# EasyEDA Pro project ProPrj_Altruist.epro, schematic Schematic TH
Board Name: BME280; Create Date: 2024-12-26; Page Name: TH; Project Name: Altruist rc: v0.1.1; Schematic Name: Schematic TH; Update Date: 2024-12-26; Company: Robonomics.network; Drawn: chegurov; Page Size: A5; Part Number: Robo_altruist; Reviewed: ludovich88; Version: V0.1
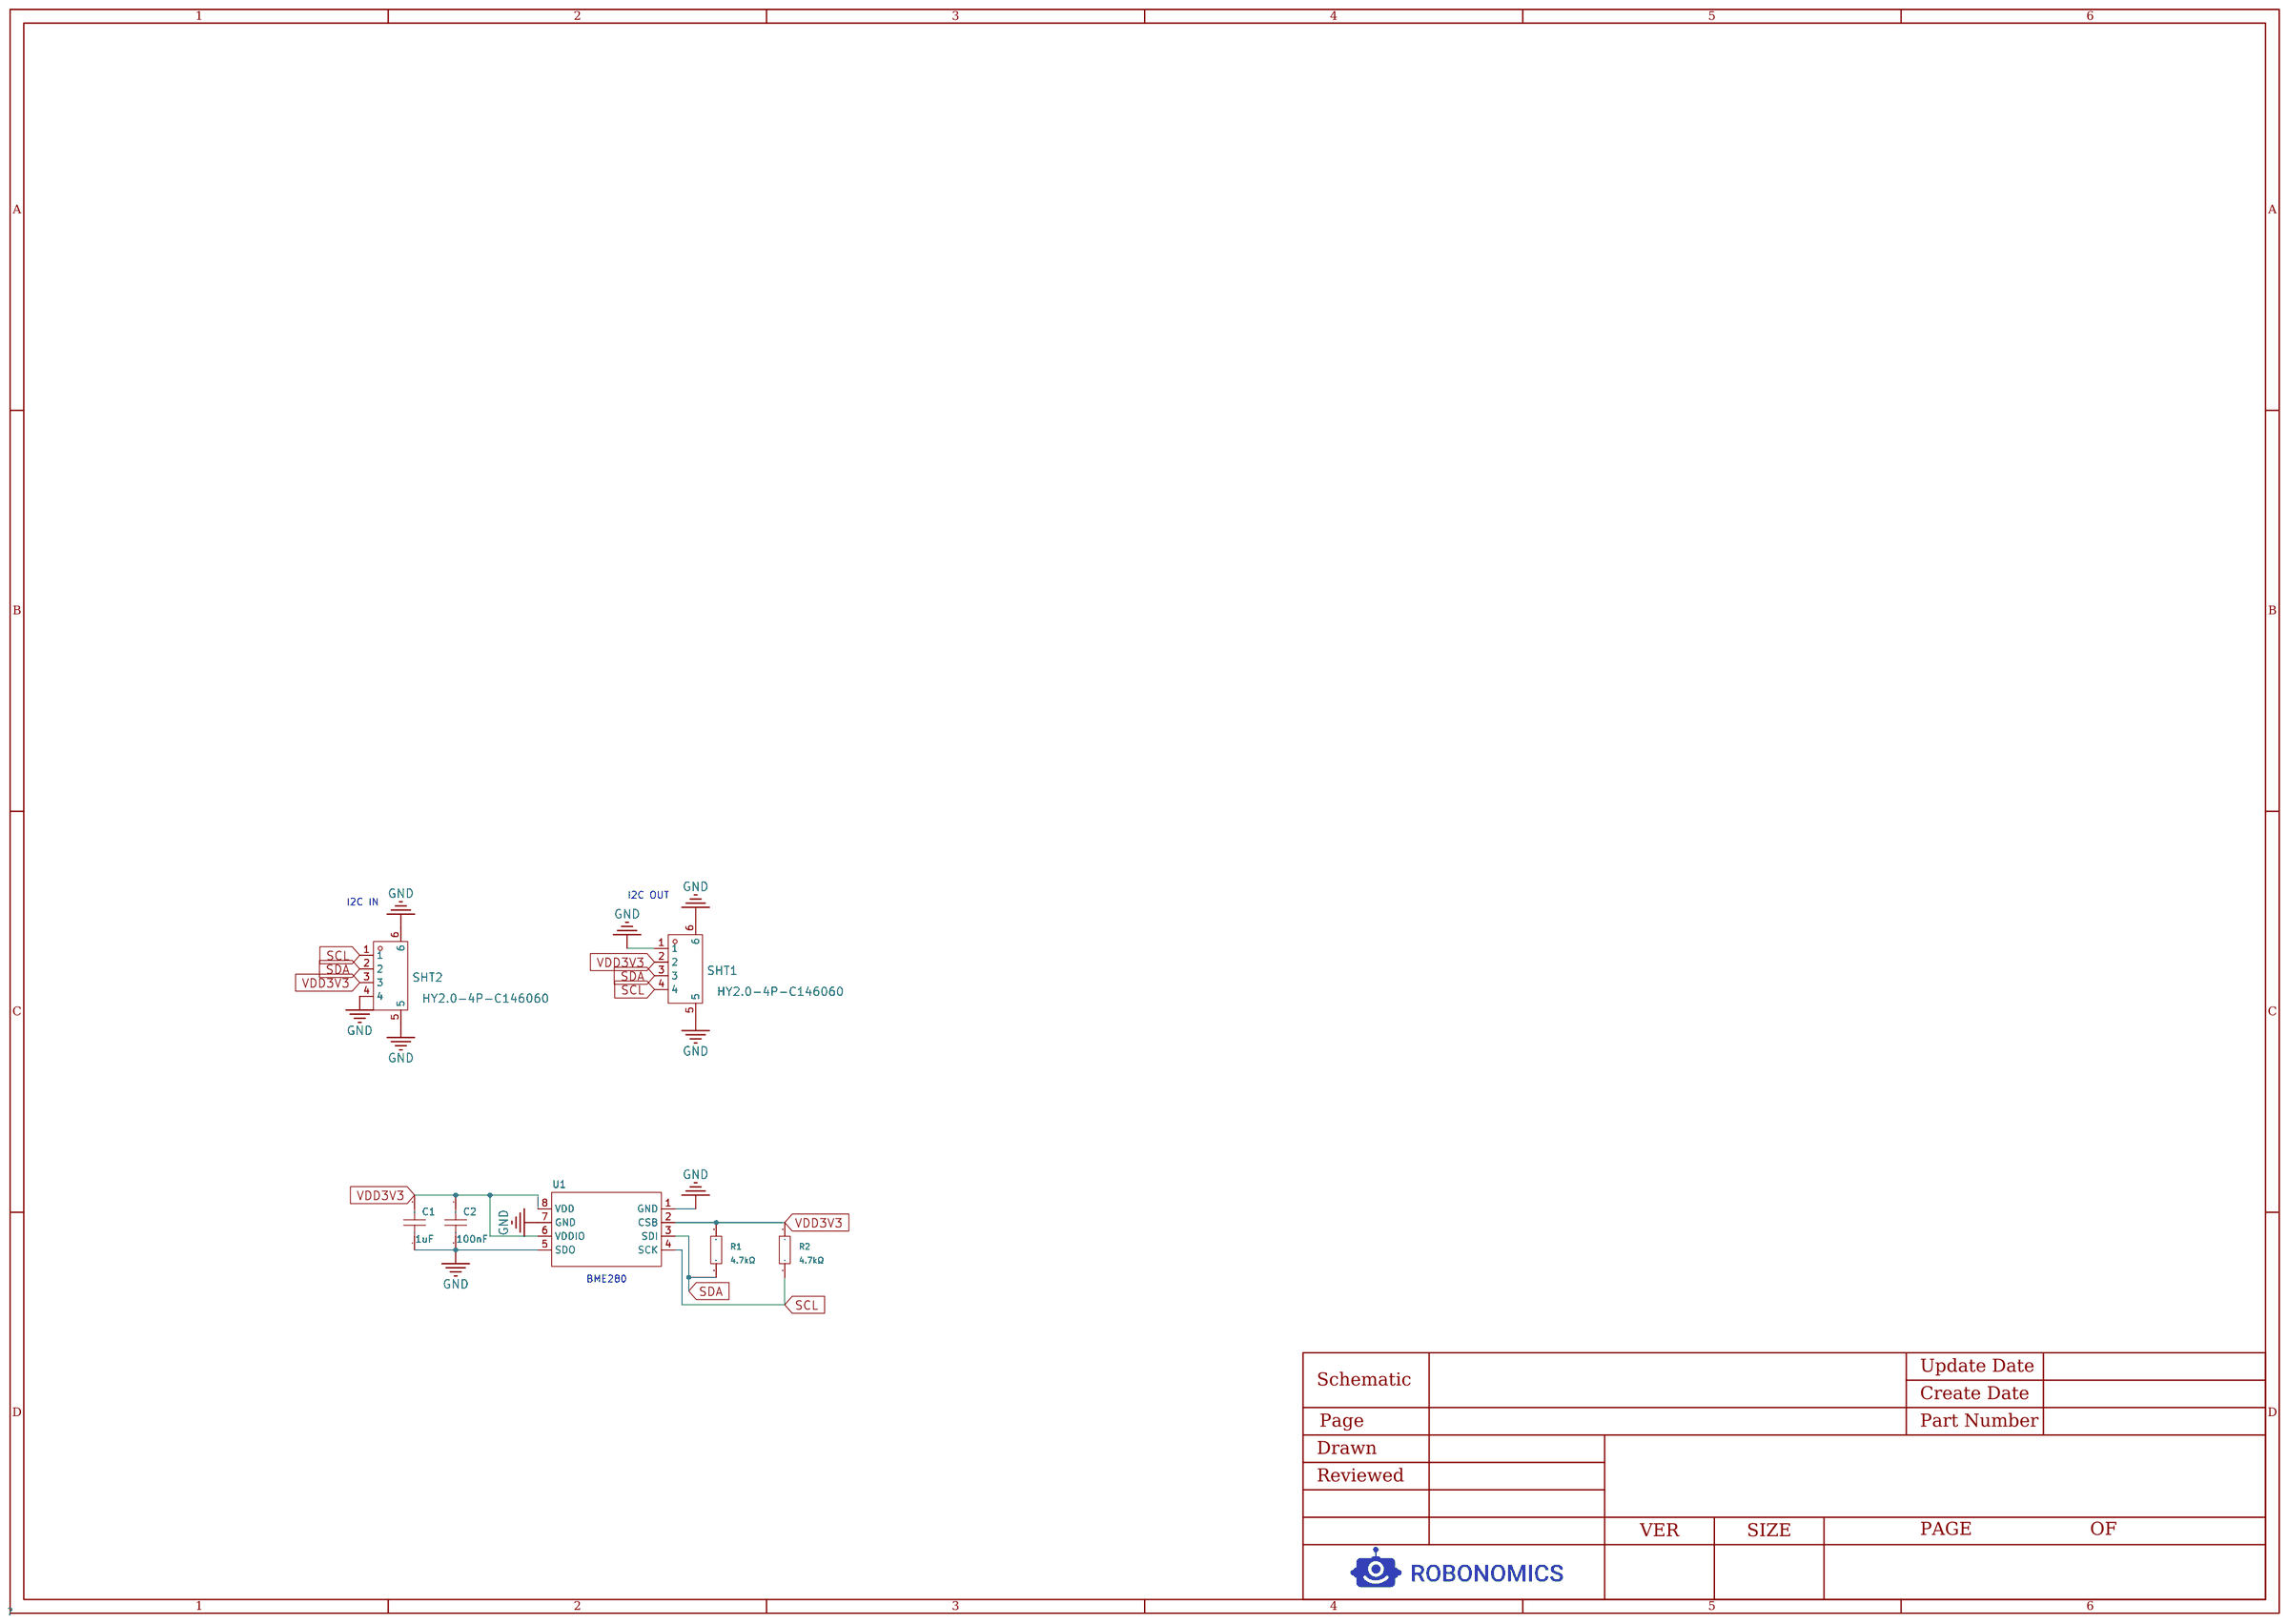
[diagram p1: schematic sheet]

## Parts
C1  1uF  [C0402]
C2  100nF  [C0402]
R1  4.7kΩ  [R0402]
R2  4.7kΩ  [R0402]
SHT1  HY2.0-4P-C146060  [CONN-SMD_HY2.0-4P]
SHT2  HY2.0-4P-C146060  [CONN-SMD_HY2.0-4P]
U1  BME280  [LGA-8_BME280_BL]

## Library data of the parts
C1 = CL05A105KA5NQNC: Capacitance: Tolerance:±10% Tolerance:±10% Voltage Rated: Temperature Coefficient:; LCSC Part Name: 1uF ±10% 25V; Supplier Part: C52923; Manufacturer: SAMSUNG(三星); Supplier Footprint: 0402; JLCPCB Part Class: Basic Part; Datasheet: https://atta.szlcsc.com/upload/public/pdf/source/20160218/1457707763339.pdf; Supplier: LCSC; Tolerance: ±10%
C2 = 0402B104K500CT: Capacitance: Tolerance:±10% Tolerance:±10% Voltage Rated: Temperature Coefficient:; LCSC Part Name: 100nF ±10% 50V; Supplier Part: C152814; Manufacturer: Walsin(华新科); Supplier Footprint: 0402; JLCPCB Part Class: Extended Part; Datasheet: https://atta.szlcsc.com/upload/public/pdf/source/20191217/C469650_84AD5C6F618CF4AC0C6D987F2E8FE6F8.pdf; Supplier: LCSC; Tolerance: ±10%
R1 R2 = 0402WGF4701TCE: Type:Thick Film Resistors Resistance:4.7kΩ Tolerance:±1% Tolerance:±1% Power(Watts): Overload Voltage (Max): Temperature Coefficient:±100ppm/℃ Temperature Coefficient:±100ppm/℃ Operating Temperature Range:-55℃~+155℃ Operating Temperature Range:-55℃~+155℃; LCSC Part Name: 4.7kΩ ±1% 62.5mW 厚膜电阻; Supplier Part: C25900; Manufacturer: UNI-ROYAL(厚声); Supplier Footprint: 0402; JLCPCB Part Class: Basic Part; Datasheet: https://atta.szlcsc.com/upload/public/pdf/source/20200306/C422600_1E6D84923E4A46A82E41ADD87F860B5C.pdf; Supplier: LCSC; Type: Thick Film Resistors; Tolerance: ±1%; Temperature Coefficient: ±100ppm/℃; Operating Temperature Range: -55℃~+155℃
SHT1 SHT2 = HY-4P卧贴: Supplier: LCSC; Supplier Part: C146060; Manufacturer: BOOMELE(博穆精密); JLCPCB Part Class: ExtendedPart; Check: true
U1 = BME280: Supply Voltage:1.71V~3.6V Supply Voltage:1.71V~3.6V; Supplier Part: C92489; Manufacturer: Bosch(博世); Supplier Footprint: LGA-8(2.5x2.5); JLCPCB Part Class: Extended Part; Datasheet: https://atta.szlcsc.com/upload/public/pdf/source/20230217/9358ECB1DA7C52D8F39392648E599102.pdf; Supplier: LCSC; Supply Voltage: 1.71V~3.6V

## Nets
GND: C1.1 C2.2 SHT1.1 SHT1.5 SHT1.6 SHT2.4 SHT2.5 SHT2.6 U1.1(GND) U1.5(SDO) U1.7(GND)
VDD3V3: C1.2 C2.1 R1.2 R2.2 SHT1.2 SHT2.3 U1.2(CSB) U1.6(VDDIO) U1.8(VDD)
SCL: R2.1 SHT1.4 SHT2.1 U1.4(SCK)
SDA: R1.1 SHT1.3 SHT2.2 U1.3(SDI)

## Notes on the sheet
- I2C IN
- I2C OUT
- BME280
